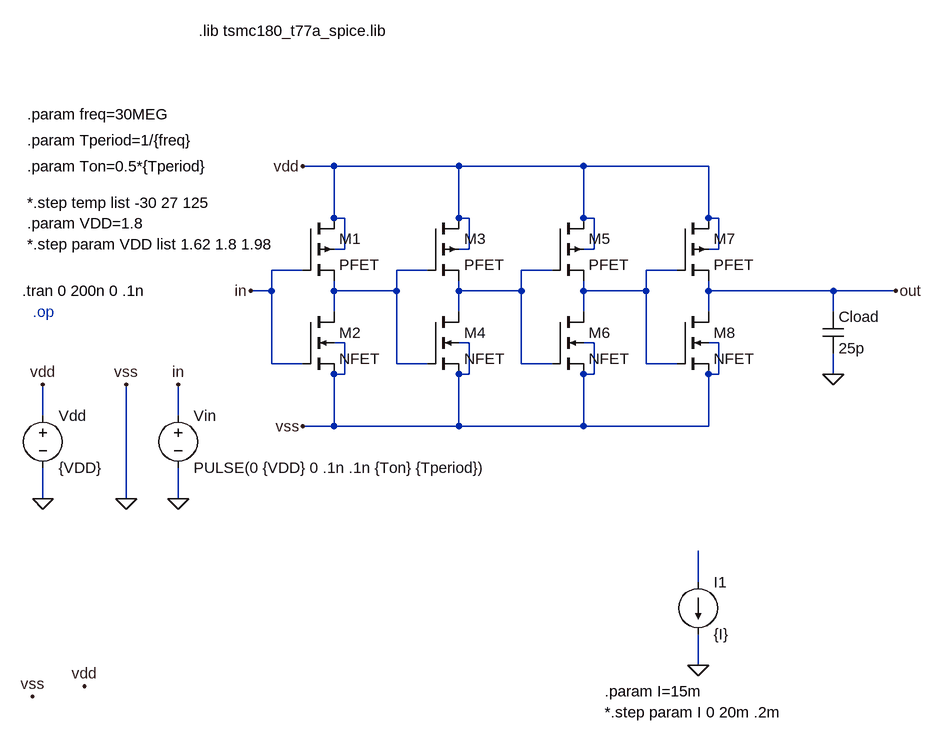
[diagram p0: schematic output_buffer.asc]
output_buffer.asc, the LTspice schematic file:
Version 4.1
SHEET 1 3108 996
WIRE 128 16 80 16
WIRE 320 16 128 16
WIRE 512 16 320 16
WIRE 704 16 512 16
WIRE 128 96 128 16
WIRE 144 96 128 96
WIRE 320 96 320 16
WIRE 336 96 320 96
WIRE 512 96 512 16
WIRE 528 96 512 96
WIRE 704 96 704 16
WIRE 720 96 704 96
WIRE 144 144 144 96
WIRE 144 144 128 144
WIRE 336 144 336 96
WIRE 336 144 320 144
WIRE 528 144 528 96
WIRE 528 144 512 144
WIRE 720 144 720 96
WIRE 720 144 704 144
WIRE 80 176 32 176
WIRE 272 176 224 176
WIRE 464 176 416 176
WIRE 656 176 608 176
WIRE 32 208 32 176
WIRE 32 208 0 208
WIRE 128 208 128 192
WIRE 224 208 224 176
WIRE 224 208 128 208
WIRE 320 208 320 192
WIRE 416 208 416 176
WIRE 416 208 320 208
WIRE 512 208 512 192
WIRE 608 208 608 176
WIRE 608 208 512 208
WIRE 704 208 704 192
WIRE 896 208 704 208
WIRE 992 208 896 208
WIRE 128 240 128 208
WIRE 320 240 320 208
WIRE 512 240 512 208
WIRE 704 240 704 208
WIRE 896 240 896 208
WIRE 144 288 128 288
WIRE 336 288 320 288
WIRE 528 288 512 288
WIRE 720 288 704 288
WIRE 32 320 32 208
WIRE 80 320 32 320
WIRE 224 320 224 208
WIRE 272 320 224 320
WIRE 416 320 416 208
WIRE 464 320 416 320
WIRE 608 320 608 208
WIRE 656 320 608 320
WIRE 144 336 144 288
WIRE 144 336 128 336
WIRE 336 336 336 288
WIRE 336 336 320 336
WIRE 528 336 528 288
WIRE 528 336 512 336
WIRE 720 336 720 288
WIRE 720 336 704 336
WIRE 896 336 896 304
WIRE -320 400 -320 352
WIRE -112 400 -112 352
WIRE 128 416 128 336
WIRE 128 416 80 416
WIRE 320 416 320 336
WIRE 320 416 128 416
WIRE 512 416 512 336
WIRE 512 416 320 416
WIRE 704 416 704 336
WIRE 704 416 512 416
WIRE -320 528 -320 480
WIRE -192 528 -192 352
WIRE -112 528 -112 480
WIRE 688 656 688 608
WIRE 688 784 688 736
FLAG 80 16 vdd
FLAG -320 528 0
FLAG -192 528 0
FLAG -192 352 vss
FLAG 80 416 vss
FLAG -320 352 vdd
FLAG 0 208 in
FLAG 992 208 out
FLAG 896 336 0
FLAG -112 528 0
FLAG -112 352 in
FLAG 688 784 0
FLAG -256 816 vdd
FLAG -336 832 vss
SYMBOL pmos4 80 96 R0
SYMATTR InstName M1
SYMATTR Value2 l=.2u w=.8u
SYMATTR Value PFET
SYMBOL nmos4 80 240 R0
SYMATTR InstName M2
SYMATTR Value2 l=.2u w=.4u
SYMATTR Value NFET
SYMBOL pmos4 272 96 R0
SYMATTR InstName M3
SYMATTR Value2 l=.2u w=8.4u
SYMATTR Value PFET
SYMBOL nmos4 272 240 R0
SYMATTR InstName M4
SYMATTR Value2 l=.2u w=4.2u
SYMATTR Value NFET
SYMBOL voltage -112 384 R0
WINDOW 123 0 0 Left 0
WINDOW 39 0 0 Left 0
SYMATTR InstName Vin
SYMATTR Value PULSE(0 {VDD} 0 .1n .1n {Ton} {Tperiod})
SYMBOL cap 880 240 R0
SYMATTR InstName Cload
SYMATTR Value 25p
SYMBOL voltage -320 384 R0
WINDOW 123 0 0 Left 0
WINDOW 39 0 0 Left 0
SYMATTR InstName Vdd
SYMATTR Value {VDD}
SYMBOL current 688 656 R0
WINDOW 123 0 0 Left 0
WINDOW 39 0 0 Left 0
SYMATTR InstName I1
SYMATTR Value {I}
SYMBOL pmos4 464 96 R0
SYMATTR InstName M5
SYMATTR Value2 l=.2u w=89u
SYMATTR Value PFET
SYMBOL nmos4 464 240 R0
SYMATTR InstName M6
SYMATTR Value2 l=.2u w=44.5u
SYMATTR Value NFET
SYMBOL pmos4 656 96 R0
SYMATTR InstName M7
SYMATTR Value2 l=.2u w=938.7u
SYMATTR Value PFET
SYMBOL nmos4 656 240 R0
SYMATTR InstName M8
SYMATTR Value2 l=.2u w=469.4u
SYMATTR Value NFET
TEXT -352 208 Left 2 !.tran 0 200n 0 .1n
TEXT -344 -64 Left 2 !.param freq=30MEG
TEXT -344 -24 Left 2 !.param Tperiod=1/{freq}
TEXT -344 16 Left 2 !.param Ton=0.5*{Tperiod}
TEXT -344 72 Left 2 !*.step temp list -30 27 125
TEXT -344 136 Left 2 !*.step param VDD list 1.62 1.8 1.98
TEXT -344 104 Left 2 !.param VDD=1.8
TEXT -80 -192 Left 2 !.lib tsmc180_t77a_spice.lib
TEXT -336 240 Left 2 ;.op
TEXT 544 824 Left 2 !.param I=15m
TEXT 544 856 Left 2 !*.step param I 0 20m .2m

The netlist it stands for:
* output_buffer.asc
M1 vdd in N001 vdd PFET l=.2u w=.8u
M2 N001 in 0 0 NFET l=.2u w=.4u
M3 vdd N001 N002 vdd PFET l=.2u w=8.4u
M4 N002 N001 0 0 NFET l=.2u w=4.2u
Vin in 0 PULSE(0 {VDD} 0 .1n .1n {Ton} {Tperiod})
Cload out 0 25p
Vdd vdd 0 {VDD}
I1 N004 0 {I}
M5 vdd N002 N003 vdd PFET l=.2u w=89u
M6 N003 N002 0 0 NFET l=.2u w=44.5u
M7 vdd N003 out vdd PFET l=.2u w=938.7u
M8 out N003 0 0 NFET l=.2u w=469.4u
.model NMOS NMOS
.model PMOS PMOS
.lib standard.mos
.tran 0 200n 0 .1n
.param freq=30MEG
.param Tperiod=1/{freq}
.param Ton=0.5*{Tperiod}
*.step temp list -30 27 125
*.step param VDD list 1.62 1.8 1.98
.param VDD=1.8
.lib tsmc180_t77a_spice.lib
* .op
.param I=15m
*.step param I 0 20m .2m
.backanno
.end